# Altium schematic sheet DebugConsole.SchDoc
size A4
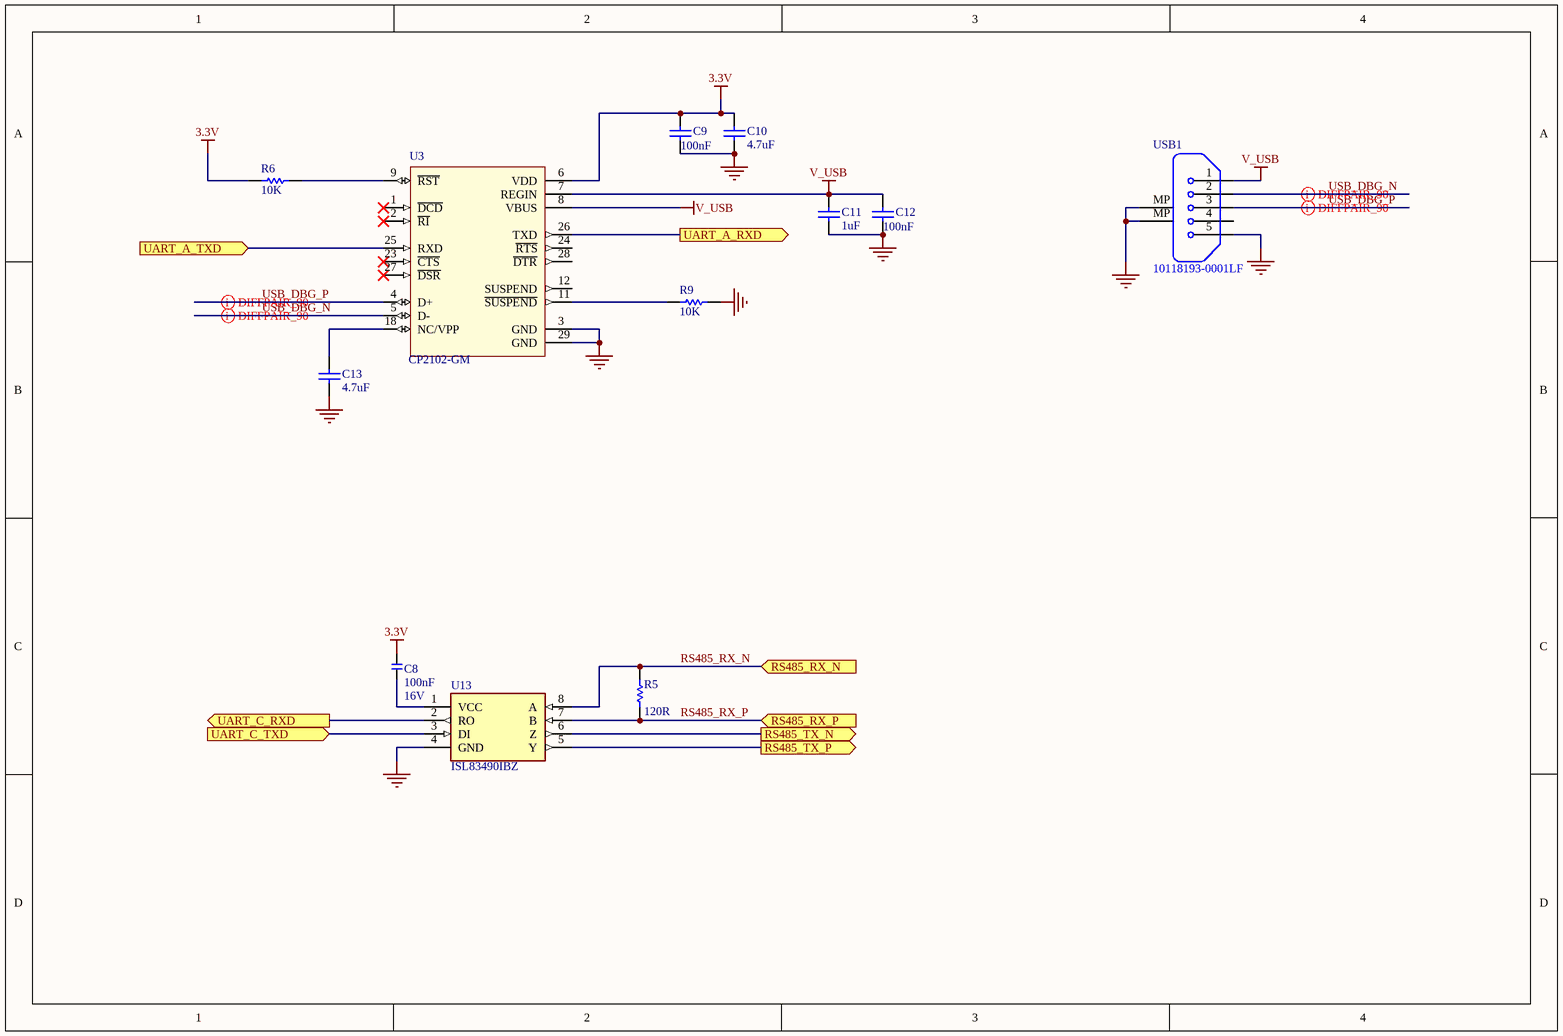
[diagram p0: DebugConsole.SchDoc]

## Parts
C8  Rating: 16V  [T_CAPC0603X33N]  (hidden comment: 100nF)
C9  100nF  [CAPC1608X06L]
C10  4.7uF  [CAPC1608X100N]
C11  1uF  [CAPC1608X100N]
C12  100nF  [CAPC1608X06L]
C13  4.7uF  [CAPC1608X100N]
R5  120R  [T_RESC0603X30N]
R6  10K  [RESC1608X50N]
R9  10K  [RESC1608X50N]
U3  CP2102-GM  [QFN50P500X500X100-29N]
U13  ISL83490IBZ  [SOIC127P600X175-8N]
USB1  10118193-0001LF  [10118193-0001LF]

## Ports
RS485_RX_N (in), RS485_RX_P (in), RS485_TX_N (out), RS485_TX_P (out), UART_A_RXD (out), UART_A_TXD (in), UART_C_RXD (out), UART_C_TXD (in)

## Nets
3.3V: C8.2 C9.1 C10.1 R6.1 U3.6(VDD)
GND: C9.2 C10.2 C11.2 C12.2 C13.2 R9.2 U3.3(GND) U3.29(GND) U13.4(GND) USB1.5 USB1.6
V_USB: C11.1 C12.1 U3.7(REGIN) U3.8(VBUS) USB1.1
RS485_RX_N: R5.2 U13.8(A) ; port RS485_RX_N
RS485_RX_P: R5.1 U13.7(B) ; port RS485_RX_P
RS485_TX_N: U13.6(Z) ; port RS485_TX_N
RS485_TX_P: U13.5(Y) ; port RS485_TX_P
UART_A_RXD: U3.26(TXD) ; port UART_A_RXD
UART_A_TXD: U3.25(RXD) ; port UART_A_TXD
UART_C_RXD: U13.2(RO) ; port UART_C_RXD
UART_C_TXD: U13.3(DI) ; port UART_C_TXD
USB_DBG_N: U3.5(D-) USB1.2
USB_DBG_P: U3.4(D+) USB1.3
NetC8_1: C8.1 U13.1(VCC)
NetC13_1: C13.1 U3.18(NC/VPP)
NetR6_2: R6.2 U3.9(~{RST})
NetR9_1: R9.1 U3.11(~{SUSPEND})

Not connected (* = marked no-connect by the designer): U3 1(~{DCD})* 2(~{RI})* 12(SUSPEND) 23(~{CTS})* 24(~{RTS}) 27(~{DSR})* 28(~{DTR}); USB1 4

## Layout directives
differential pair: USB_DBG_N, USB_DBG_P

## Notes on the sheet
- (in symbol USB Micro-B) MP

## Library data of the parts
C8 = C-X7R-100nF-16V-10%-0603: Capacitor Ceramic X7R 100nF 16V 10% 0603; Tolerance: 10%; Type: X7R; Value: 100nF
C9 C12 = Cap: Capacitor; mpn: MC0603B104K250CT; E14 pn: 2310560; LatestRevisionNote: Re-released for DXP Platform.; PackageReference: RAD-0.3; Publisher: Altium Limited; PackageDescription: Radial Cap, Thru-Hole; 2 Leads; 0.3 in Pin Spacing; Value: 100nF
C10 C13 = CAP: mpn: C0603C475K9PACTU; E14 pn: 9227784; Value: 4.7uF
C11 = CAP: mpn: C0603C105K8PACTU; E14 pn: 9227776; Value: 1uF
R5 = Res1: Resistor; Published: 8-Jun-2000; LatestRevisionDate: 17-Jul-2002; LatestRevisionNote: Re-released for DXP Platform.; PackageReference: AXIAL-0.3; Publisher: Altium Limited; PackageDescription: Axial Device, Thru-Hole; 2 Leads; 0.3 in Pin Spacing; Value: 120R
R6 R9 = Res1: Resistor; mpn: CRCW060310K0FKEAHP; E14: 1738918; LatestRevisionDate: 17-Jul-2002; LatestRevisionNote: Re-released for DXP Platform.; PackageReference: AXIAL-0.3; PackageDescription: Axial Device, Thru-Hole; 2 Leads; 0.3 in Pin Spacing; Value: 10K
U3 = CP2102-GM: USB Bridge, USB to UART USB 2.0 UART Interface 28-QFN (5x5); E14 pn: 9282130; MF: Silicon Labs; Package: QFN-28 Silicon Labs; mpn: CP2102-GM; SnapEDA_Link: https://www.snapeda.com/parts/CP2102-GM/Silicon%20Labs/view-part/135876/?ref=snap; Value: *
U13 = ISL83490IBZ: 1/1 Transceiver Full RS422, RS485 8-SOIC; MF: Renesas / Intersil; Value: *; Digi-Key_Part_Number: ISL83490IBZ-TTR-ND; Package: SOIC-8 Renesas / Intersil; SnapEDA_Link: https://www.snapeda.com/parts/ISL83490IBZ/Intersil/view-part/4709839/?ref=snap; Digi-Key_Purchase_URL: https://www.digikey.com/product-detail/en/renesas-electronics-america-inc/ISL83490IBZ-T/ISL83490IBZ-TTR-ND/1065061?utm_source=snapeda&utm_medium=aggregator&utm_campaign=symbol; MP: ISL83490IBZ
USB1 = USB Micro-B: Value: Micro USB Type B; E14 pn: 2751675; mpn: 10118193-0001LF